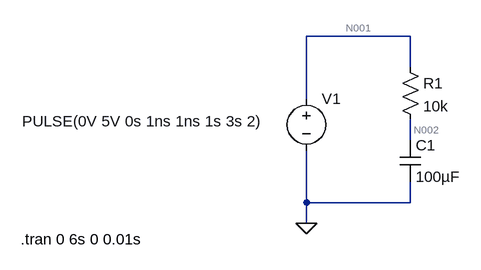
[diagram p0: schematic INCLASS.asc]
INCLASS.asc, the LTspice schematic file:
Version 4
SHEET 1 880 680
WIRE 256 -144 96 -144
WIRE 256 -96 256 -144
WIRE 96 -48 96 -144
WIRE 256 16 256 -16
WIRE 96 112 96 32
WIRE 256 112 256 80
WIRE 256 112 96 112
WIRE 96 144 96 112
FLAG 96 144 0
SYMBOL cap 240 16 R0
SYMATTR InstName C1
SYMATTR Value 100µF
SYMBOL res 240 -112 R0
SYMATTR InstName R1
SYMATTR Value 10k
SYMBOL voltage 96 -64 R0
WINDOW 3 -438 51 Left 2
WINDOW 123 0 0 Left 0
WINDOW 39 0 0 Left 0
SYMATTR InstName V1
SYMATTR Value PULSE(0V 5V 0s 1ns 1ns 1s 3s 2)
TEXT -344 168 Left 2 !.tran 0 6s 0 0.01s

The netlist it stands for:
* INCLASS.asc
C1 N002 0 100µF
R1 N001 N002 10k
V1 N001 0 PULSE(0V 5V 0s 1ns 1ns 1s 3s 2)
.tran 0 6s 0 0.01s
.backanno
.end

* Results of the author's LTspice run, read from the files saved beside the schematic
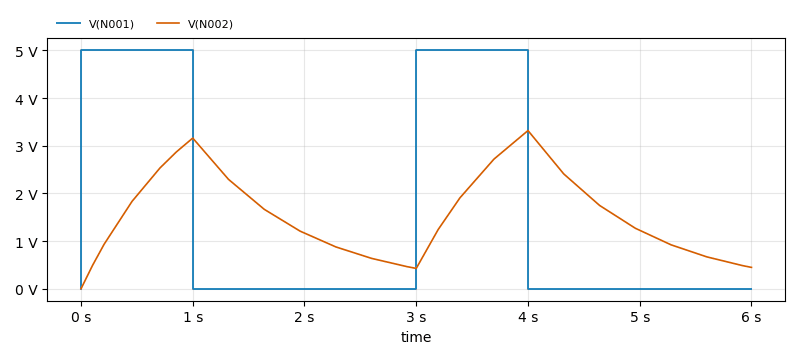
[diagram p1: Transient Analysis of INCLASS.asc, plotted from the saved traces]
* Transient Analysis, 1 run:
*   V(N001): min 0 V, max 5 V, average 1.667 V, rms 2.887 V, last 0 V
*   V(N002): min 0 V, max 3.318 V, average 1.595 V, rms 1.828 V, last 449 mV